# EAGLE design Motors (EAGLE 7.7.0)
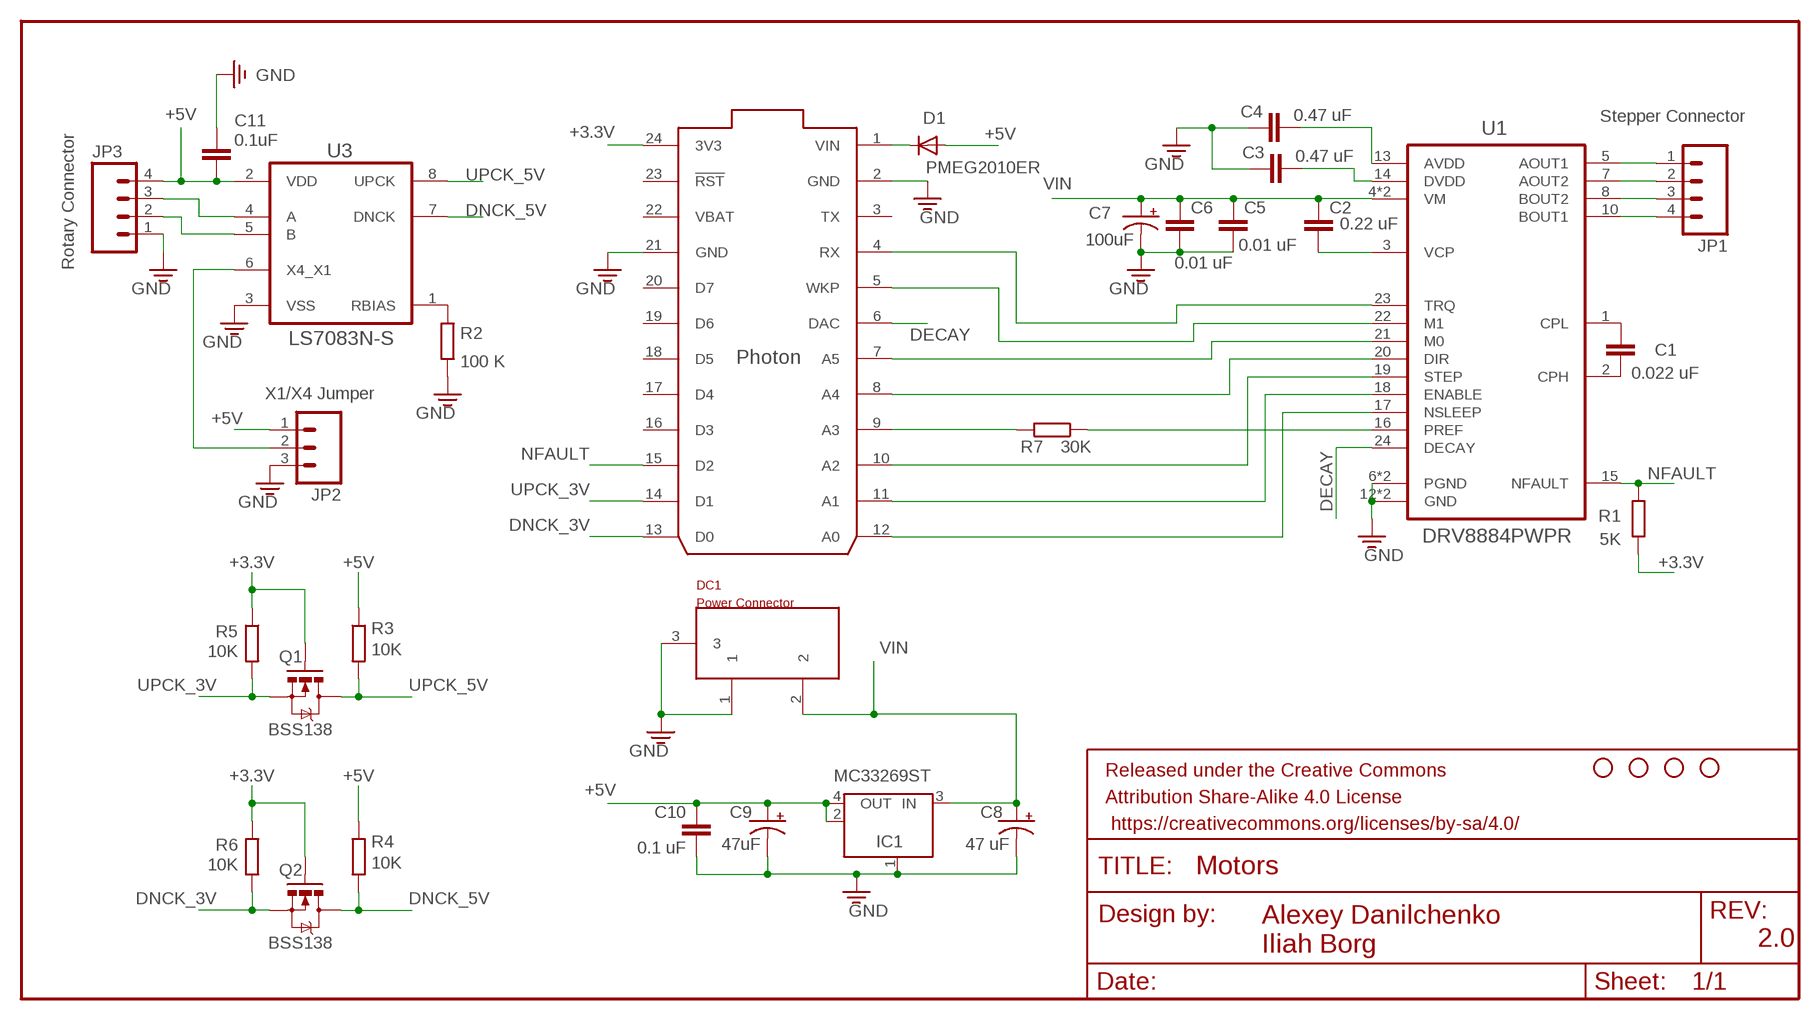
[diagram p0: schematic, sheet 1]

## Parts
C1  0.022 uF  C-EUC0805  [C0805]
C2  0.22 uF  C-EUC0805  [C0805]
C3  0.47 uF  C-EUC0805  [C0805]
C4  0.47 uF  C-EUC0805  [C0805]
C5  0.01 uF  C-EUC0805  [C0805]
C6  0.01 uF  C-EUC0805  [C0805]
C7  100uF  CPOL-USCT7343  [CT7343]
C8  47 uF  CPOL-USCT7343  [CT7343]
C9  47uF  CPOL-USCT7343  [CT7343]
C10  0.1 uF  C-EUC0805  [C0805]
C11  0.1uF  C-EUC0805  [C0805]
D1  PMEG2010ER  DIODE-SOD123  [SOD123]
DC1  Power Connector  POWERSUPPLY_DC21MMX  [POWERSUPPLY_DC-21MM]
FRAME1  FRAME-LETTER  [CREATIVE_COMMONS]
IC1  MC33269ST  [SOT223]
JP1  Stepper Connector  M04PTH  [1X04]
JP2  X1/X4 Jumper  M03PTH  [1X03]
JP3  Rotary Connector  M04PTH  [1X04]
Q1  BSS138  MOSFET-NCHANNELSMD  [SOT23-3]
Q2  BSS138  MOSFET-NCHANNELSMD  [SOT23-3]
R1  5K  R-EU_R0805  [R0805]
R2  100 K  R-EU_R0805  [R0805]
R3  10K  R-EU_R0805  [R0805]
R4  10K  R-EU_R0805  [R0805]
R5  10K  R-EU_R0805  [R0805]
R6  10K  R-EU_R0805  [R0805]
R7  30K  R-EU_R0805  [R0805]
STANDOFF1  STAND-OFF  [STAND-OFF]
STANDOFF2  STAND-OFF  [STAND-OFF]
STANDOFF3  STAND-OFF  [STAND-OFF]
STANDOFF4  STAND-OFF  [STAND-OFF]
U1  DRV8884PWPR  [SOP65P640X120-29N]
U2  PHOTON_WITH_HEADERS  [PHOTON]
U3  LS7083N-S  LSI7083N-S  [SOIC127P600X175-8N]

## Nets
+3.3V: Q1.1(G) Q2.1(G) R1.1 R5.1 R6.1 U2.24(3V3)
+5V: C9.+ C10.1 C11.2 D1.A IC1.2(OUT) IC1.4(OUT) JP2.1 JP3.4 R3.1 R4.1 U3.2(VDD)
DECAY: U1.24(DECAY) U2.6(DAC)
DNCK_3V: Q2.2(S) R6.2 U2.13(D0)
DNCK_5V: Q2.3(D) R4.2 U3.7(DNCK)
GND: C3.2 C4.2 C5.2 C6.2 C7.- C8.- C9.- C10.2 C11.1 DC1.1 DC1.3 IC1.1(GND/ADJ) JP2.3 JP3.1 R2.2 U1.6(PGND) U1.9(PGND) U1.12(GND) U1.25(GND) U2.2(GND) U2.21(GND) U3.3(VSS)
N$1: U1.18(ENABLE) U2.11(A1)
N$2: C2.2 U1.3(VCP)
N$3: C1.1 U1.2(CPH)
N$4: C1.2 U1.1(CPL)
N$5: U1.22(M1) U2.5(WKP)
N$6: U1.17(NSLEEP) U2.12(A0)
N$7: R7.1 U1.16(PREF)
N$8: C4.1 U1.13(AVDD)
N$9: C3.1 U1.14(DVDD)
N$10: D1.C U2.1(VIN)
N$11: U1.19(STEP) U2.10(A2)
N$12: U1.20(DIR) U2.8(A4)
N$13: U1.21(M0) U2.7(A5)
N$14: U1.23(TRQ) U2.4(RX)
N$15: R7.2 U2.9(A3)
N$18: R2.1 U3.1(RBIAS)
N$19: JP1.1 U1.5(AOUT1)
N$20: JP1.2 U1.7(AOUT2)
N$21: JP2.2 U3.6(X4_X1)
N$22: JP1.3 U1.8(BOUT2)
N$23: JP1.4 U1.10(BOUT1)
NFAULT: R1.2 U1.15(NFAULT) U2.15(D2)
ROTARY_A: JP3.3 U3.4(A)
ROTARY_B: JP3.2 U3.5(B)
UPCK_3V: Q1.2(S) R5.2 U2.14(D1)
UPCK_5V: Q1.3(D) R3.2 U3.8(UPCK)
VIN: C2.1 C5.1 C6.1 C7.+ C8.+ DC1.2 IC1.3(IN) U1.4(VM) U1.11(VM)
Unconnected: U2.3(TX) U2.16(D3) U2.17(D4) U2.18(D5) U2.19(D6) U2.20(D7) U2.23(!RST)

## Power pins joined to a net without a drawn wire
VBAT: U2.22(VBAT)

## Library data of the parts
C1-C6 C10 C11 = Spectron2:C-EU: CAPACITOR, European symbol
C7-C9 = Spectron2:CPOL-US: POLARIZED CAPACITOR, American symbol
D1 = Spectron2:DIODE-: DIODE
DC1 = Spectron2:POWERSUPPLY_DC21MM
FRAME1 = SparkFun-Aesthetics:FRAME-LETTER: Schematic Frame Standard 8.5x11 US Letter frame
IC1 = Spectron:MC33269ST*: Adjustable Output Low Dropout Voltage Regulator 800 mA Source: http://www.onsemi.com/pub/Collateral/MC33269-D.PDF
JP1 JP3 = SparkFun-Connectors:M04: Header 4 Standard 4-pin 0.1" header. Use with straight break away headers (SKU : PRT-00116), right angle break away headers (PRT-00553), swiss pins (PRT-00743), machine pins (PRT-00117), and female headers (PRT-00115). Molex polarized connector foot print use with SKU : PRT-08231 with associated crimp pins and housings. 1MM SMD Version SKU: PRT-10208
JP2 = SparkFun-Connectors:M03: Header 3 Standard 3-pin 0.1" header. Use with straight break away headers (SKU : PRT-00116), right angle break away headers (PRT-00553), swiss pins (PRT-00743), machine pins (PRT-00117), and female headers (PRT-00115). Molex polarized connector foot print use with SKU : PRT-08232 with associated crimp pins and housings.
Q1 Q2 = SparkFun:MOSFET-NCHANNEL
R1-R7 = Spectron2:R-EU_: RESISTOR, European symbol
STANDOFF1-STANDOFF4 = Spectron2:STAND-OFF: #4 Stand Off This is the mechanical footprint for a #4 phillips button head screw. Use the keepout ring to avoid running the screw head into surrounding components. SKU : PRT-00447
U1 = TI-DRV8884:DRV8884PWPR: STEPPER MOTOR CONTROLLER; MPN: DRV8884PWPR; OC_FARNELL: -; OC_NEWARK: 24R9117; PACKAGE: TSSOP-28; SUPPLIER: Texas Instruments
U2 = Spectron2:PHOTON
U3 = LSI-LS7083NS:LSI7083N-S: Precision Micropower, Low Dropout Voltage References; MPN: LS7083N-S; OC_FARNELL: -; PACKAGE: SOIC-8; SUPPLIER: LSI/CSI

## Board
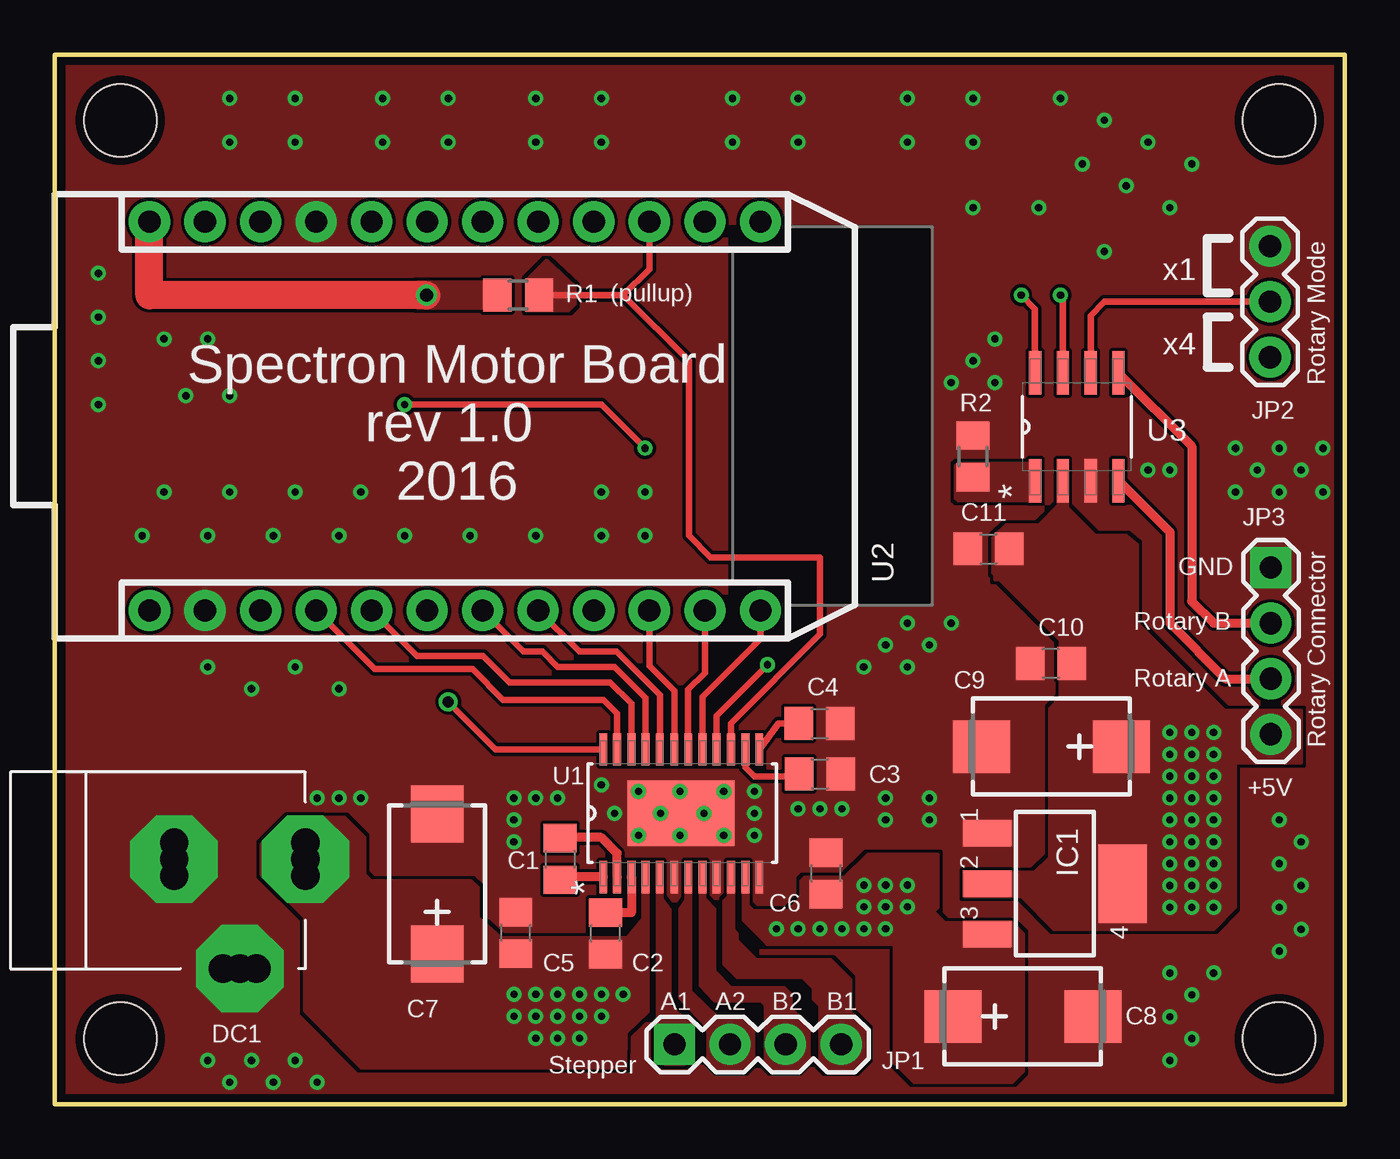
[diagram p1: board, top side]
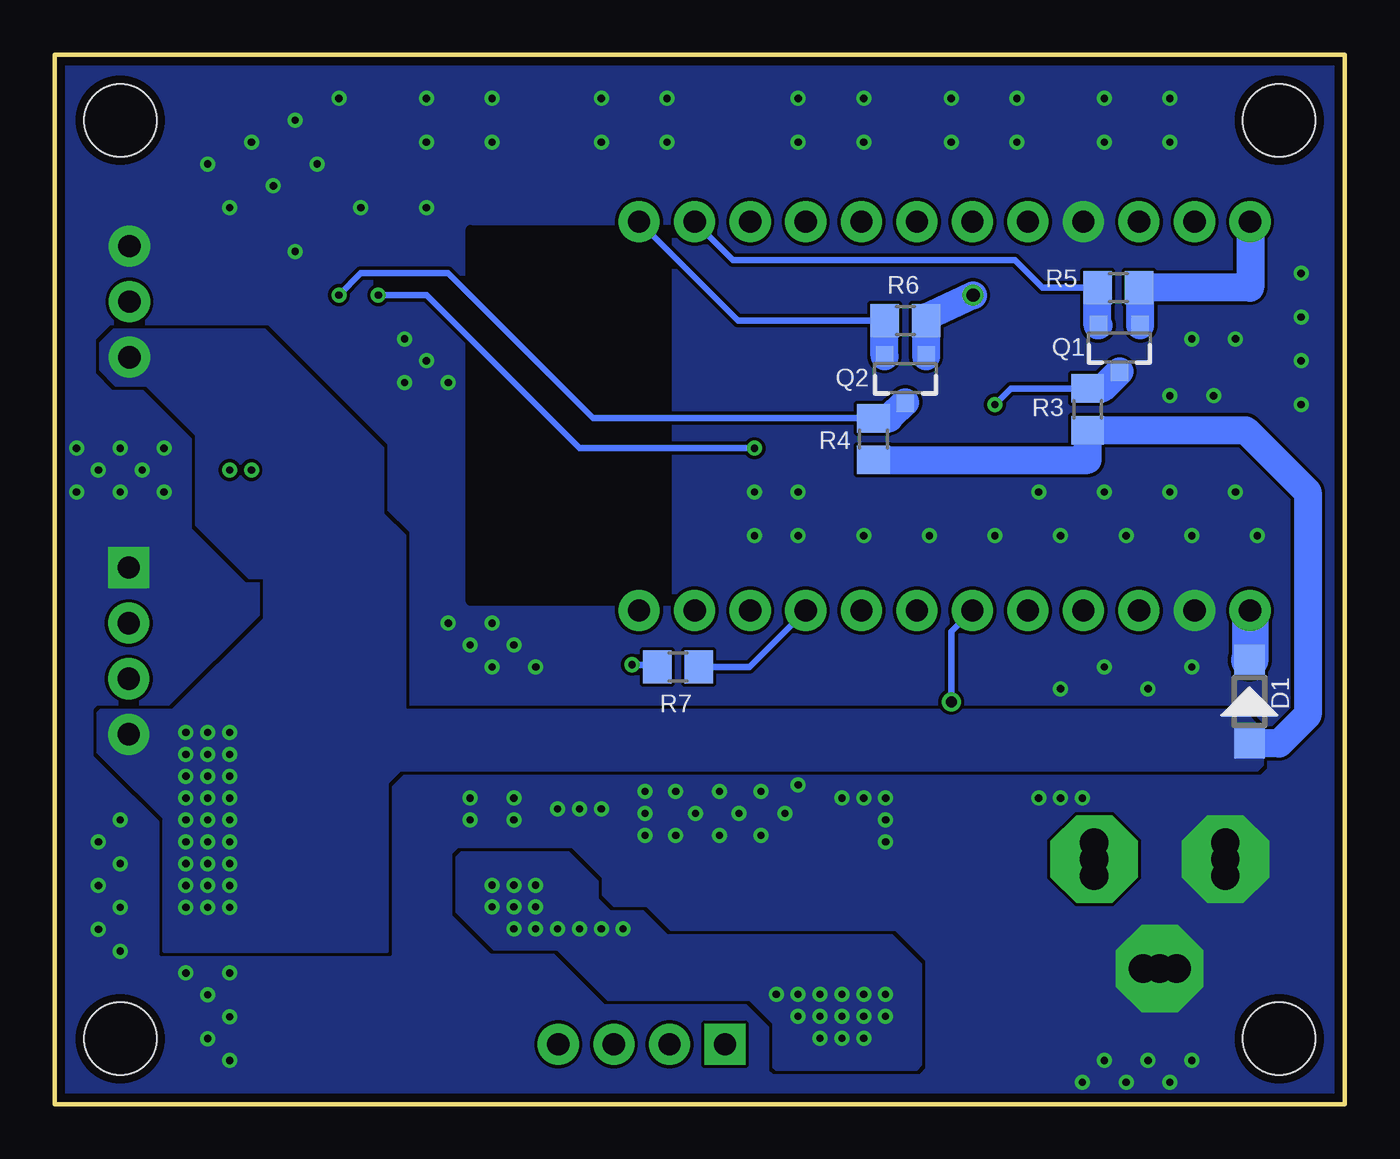
[diagram p2: board, bottom side, seen from below]

Size 59 x 48 mm. Coordinates in mm from the lower left corner, seen from the top.
Outline: 59,0 59,48 0,48 0,0 59,0
Copper layers (1*16): Top 0.0356mm / dielectric 1.5011mm / Bottom 0.0356mm
Design rules "oshpark-2layer *": minimum track width 6mil, minimum drill 13mil, track to track 6mil, track to pad 6mil, pad to pad 6mil, via to via 6mil, smd to smd 0mil, copper to edge 15mil, drill to drill 6mil, minimum pad ring 7mil, minimum via ring 7mil, stop-mask expansion 2.5mil, vias tented up to drill 0mil, thermal gap 10mil

### Footprints (pad centres in the part's own frame; a part is rotated, then mirrored left to right if it is on the bottom)
C0805 = smd 1.3 x 1.5: 1 -0.95,0; 2 0.95,0
CT7343 = smd 2.6 x 2.4: + 3.2,0; - -3.2,0
SOD123 = smd 1.4 x 1.4: A 1.9,0; C -1.9,0
POWERSUPPLY_DC-21MM = drill 1.3 pad 4 octagon: 1 -5.08,-3.353; 2 -0.076,-6.35; 3 -0.076,-0.356 | drill 1.3: 4 -5.08,-4.115; 5 -5.08,-2.591; 6 -0.838,-0.356; 7 0.686,-0.356; 8 -0.838,-6.35; 9 0.686,-6.35
SOT223 = smd 1.219 x 2.235: 1 -2.311,-3.099; 2 0,-3.099; 3 2.311,-3.099 | smd 3.6 x 2.2: 4 0,3.099
1X04 = drill 1.016 pad 1.88 square: 1 0,0 | drill 1.016 pad 1.88: 2 2.54,0; 3 5.08,0; 4 7.62,0
1X03 = drill 1.016 pad 1.88: 1 0,0; 2 2.54,0; 3 5.08,0
SOT23-3 = smd 0.8 x 0.9: 1 -0.95,-1; 2 0.95,-1; 3 0,1.1
R0805 = smd 1.3 x 1.5: 1 -0.95,0; 2 0.95,0
STAND-OFF = hole 3.302: 0,0
SOP65P640X120-29N = smd 1.473 x 0.356: 1 -2.921,3.566; 2 -2.921,2.931; 3 -2.921,2.271; 4 -2.921,1.636; 5 -2.921,0.976; 6 -2.921,0.315; 7 -2.921,-0.32; 8 -2.921,-0.98; 9 -2.921,-1.615; 10 -2.921,-2.276; 11 -2.921,-2.936; 12 -2.921,-3.571; 13 2.921,-3.571; 14 2.921,-2.936; 15 2.921,-2.276; 16 2.921,-1.615; 17 2.921,-0.98; 18 2.921,-0.32; 19 2.921,0.315; 20 2.921,0.976; 21 2.921,1.636; 22 2.921,2.271; 23 2.921,2.931; 24 2.921,3.566 | smd 3 x 4.9: 25 0,0
PHOTON = drill 1.016 pad 1.88: 1 1.27,32.258; 2 1.27,29.718; 3 1.27,27.178; 4 1.27,24.638; 5 1.27,22.098; 6 1.27,19.558; 7 1.27,17.018; 8 1.27,14.478; 9 1.27,11.938; 10 1.27,9.398; 11 1.27,6.858; 12 1.27,4.318; 13 19.05,4.318; 14 19.05,6.858; 15 19.05,9.398; 16 19.05,11.938; 17 19.05,14.478; 18 19.05,17.018; 19 19.05,19.558; 20 19.05,22.098; 21 19.05,24.638; 22 19.05,27.178; 23 19.05,29.718; 24 19.05,32.258
SOIC127P600X175-8N = smd 1.981 x 0.559: 1 -2.464,1.905; 2 -2.464,0.635; 3 -2.464,-0.635; 4 -2.464,-1.905; 5 2.464,-1.905; 6 2.464,-0.635; 7 2.464,0.635; 8 2.464,1.905

### Placement (x,y rotation side)
C1  23.11,11.21 270 top
C2  25.19,7.81 90 top
C3  34.99,15.11 0 top
C4  34.97,17.41 0 top
C5  21.09,7.83 90 top
C6  35.28,10.56 90 top
C7  17.49,10.08 270 top
C8  44.27,4.01 180 top
C9  45.58,16.35 0 top
C10  45.56,20.16 180 top
C11  42.7,25.4 0 top
D1  4.36,18.42 270 bottom
DC1  5.11,11.28 90 top
FRAME1  3.96,40.12 0 top
IC1  45.74,10.09 270 top
JP1  28.35,2.73 0 top
JP2  55.58,34.16 90 top
JP3  55.62,24.54 270 top
Q1  10.31,34.61 180 bottom
Q2  20.1,33.21 180 bottom
R1  21.2,37 0 top
R2  41.99,29.63 90 top
R3  11.76,31.78 90 bottom
R4  21.56,30.42 90 bottom
R5  10.36,37.34 180 bottom
R6  20.1,35.84 180 bottom
R7  30.5,20 0 bottom
STANDOFF1  56,3 0 top
STANDOFF2  56,45 0 top
STANDOFF3  3,3 0 top
STANDOFF4  3,45 0 top
U1  28.65,13.31 90 top
U2  36.59,21.31 90 top
U3  46.74,30.98 90 top

### Tracks (layer width: path | path; a pad name or v marks a point on that pad's centre or on a via)
+3.3V  (via drill 0.6)
  Top 1.27: v17,37 4.33,37 U2.24
  Bottom 1.27: U2.24 4.33,37.34 R5.1 9.36,37.34 Q1.1 | v17,37 19.15,36 R6.1 Q2.1
  pour Top (no thermals): 16.6,37.6 20.8,37.6 20.8,36.4 16.6,36.4
+5V  (via drill 0.33)
  Bottom 1.27: D1.A 4.34,16.5 3,16.5 1.7,17.8 1.7,28 4.53,30.83 R3.1 11.76,29.47 R4.1
  other vias: 51,17 52,17 53,17 53,16 53,15 53,14 53,13 53,12 52,16 52,15 52,14 52,13 52,12 51,12 51,13 51,16 51,15 51,14 51,11 52,11 53,11 51,10 52,10 53,10 53,9 52,9 51,9
  pour Bottom (no thermals): 3.78,15.96 3.78,15.52 4,15.3 43.8,15.3 43.8,7 54,7 54,18 4.7,18 3.77,17.07 3.77,16.19 arc90 3.96,16 4,16
  pour Top (no thermals): 45.9,28.9 45.9,27.4 45,26.5 43.5,26.5 43,26 43,24 49,24 49,26 47.6,26 46.3,27.3 46.3,28.9
  pour Top (no thermals): 41.6,10.6 44.8,10.6 45.5,11.3 45.5,18.1 46,18.6 46,21.2 42.9,24.3 42.9,25.9 43,26 49,26 49.5,25.6 49.5,22 53.5,18 57,18 57,15.6 54,15.6 54,9 53,8 45.7,8 44.2,9.5 41.6,9.5
  pour Bottom (no thermals): 56.7,35 56.3,35.4 53.2,35.4 49.4,35.4 44,30 44,27 43,26 43,24.2 43.1,24.1 50.1,24.1 52.5,26.5 52.5,30.6 54.8,32.9 56.2,32.9 56.9,33.6 56.9,34.8
  pour Bottom (no thermals): 43,25.7 43,15.5 46,12.5 53.4,12.5 57,16.1 57,17.9 56.9,18 53.6,18 49.4,22.2 49.4,25.7 49.1,26 43.9,26 43.3,26
DECAY  (via drill 0.51 pad 0.18)
  Top 0.305: U1.24 20.17,16.23 v18,18.4
  Bottom 0.305: v18,18.4 18,21.61 U2.6
DNCK_3V
  Bottom 0.305: U2.13 27.75,35.84 R6.2
  Bottom 1.27: Q2.2 R6.2
DNCK_5V  (via drill 0.33)
  Top 0.305: v46,37 46.1,36.9 U3.7
  Bottom 0.305: R4.2 34.37,31.37 41,38 45,38 v46,37
  Bottom 1.27: Q2.3 20.84,31.37 R4.2
GND  (via drill 0.33 pad 0.18)
  other vias: 10,26 14,28 16,26 19,26 22,26 25,26 27,28 8,28 5,28 4,26 7,26 27,26 25,28 8,46 11,46 11,44 8,44 15,44 18,44 18,46 15,46 22,46 25,46 25,44 22,44 2,38 2,36 2,34 31,46 31,44 2,32 5,35 7,35 34,46 34,44 39,46 42,46 42,44 39,44 46,46 48,45 50,44 52,43 47,43 49,42 51,41 45,41 42,41 48,39 54,30 51,29 50,29 56,30 41,22 39,22 38,21 37,20 39,20 40,21 38,14 40,14 40,13 38,13 32,14.3 32,13.3 32,12.3 25,14.6 25.6,13.3 36,13.5 35,13.5 34,13.5 30.6,14.3 29.7,13.3 28.6,12.3 28.6,14.3 26.7,14.3 26.7,12.3 27.7,13.3 30.6,12.3 23,14 22,14 21,14 21,13 21,12 14,14 13,14 12,14 13,19 11,20 9,19 7,20 7,2 9,2 11,2 10,1 8,1 12,1 56,13 57,12 56,11 56,9 56,7 57,10 57,8 51,6 52,5 53,6 51,4 52,3 51,2 55,29 57,29 58,30 56,28 54,28 58,28 42,34 43,35 41,33 43,33 6,32.4 8,32.4 11,28 13,26
  pour Top (rank 6, no thermals): 0,0 59,0 59,48 0,48
  pour Bottom (rank 6, no thermals): 0,0 59,0 59,48 0,48
N$1
  Top 0.305: U1.18 28.97,18.97 29.73,19.73 U2.11
N$2
  Top 0.406: U1.3 26.38,8.76 C2.2
N$3
  Top 0.406: U1.2 25.72,11.48 25,12.2 23.45,12.2 C1.1
N$4
  Top 0.406: U1.1 23.54,10.39 C1.2
N$5
  Top 0.305: U1.22 26.38,18.32 25.4,19.3 20.8,19.3 19.6,20.5 16.57,20.5 U2.5
N$6
  Top 0.305: U1.17 29.63,18.63 32.27,21.27 U2.12
N$7  (via drill 0.33 pad 0.18)
  Top 0.305: U1.16 30.27,17.77 v32.6,20.1
  Bottom 0.305: v32.6,20.1 31.55,20.1 R7.1
N$8
  Top 0.305: U1.13 33.1,17.41 C4.1
N$9
  Top 0.305: U1.14 31.59,15.41 32,15 33.93,15 C3.1
N$10
  Bottom 1.676: D1.C 4.33,20.35 U2.1
N$11
  Top 0.305: U1.19 28.34,18.9 27.19,20.04 U2.10
N$12
  Top 0.305: U1.20 27.67,18.73 25.7,20.7 23.99,20.7 U2.8
N$13
  Top 0.305: U1.21 27.01,18.59 25.6,20 23,20 22.3,20.7 21.45,20.7 U2.7
N$14
  Top 0.305: U1.23 25.72,17.88 25.1,18.5 20.5,18.5 19.1,19.9 14.63,19.9 U2.4
N$15
  Bottom 0.305: R7.2 27.23,20 U2.9
N$18
  pour Top (no thermals): 41.4,29.3 45,29.3 45,27.7 44.9,27.6 41.3,27.6 41.2,27.7 41.2,29.2 41.3,29.3
N$19
  pour Top (no thermals): 27.57,10.38 27.57,2.13 27.89,1.83 28.8,1.83 29.11,2.13 29.11,3.66 28.13,4.49 28.13,8.92 27.78,9.4 27.78,10.4 27.6,10.4
N$20
  pour Top (no thermals): 28.88,10.51 28.87,9.35 28.59,8.93 28.59,4.83 29.87,3.51 29.87,1.98 30.33,1.52 31.55,1.52 31.96,1.93 31.96,3.4 31.39,3.96 30.33,3.96 29.08,5.17 29.08,10.51
N$21
  Top 0.305: U3.6 47.38,36.08 48,36.7 JP2.2
N$22
  pour Top (no thermals): 29.57,10.52 29.53,10.46 29.53,5.41 30.18,4.72 32.31,4.72 32.5,4.53 32.5,1.8 32.78,1.52 33.99,1.52 34.49,2.03 34.49,3.51 33.68,4.42 33.68,5.03 33.38,5.33 30.94,5.33 30.18,6.1 30.18,8.94 29.73,9.42 29.73,10.54
N$23
  pour Top (no thermals): 30.82,10.5 30.82,9.5 30.6,9.3 30.6,6.4 31.2,5.8 34.2,5.8 34.7,5.3 34.7,4.8 35,4.5 35,1.8 35.3,1.5 36.6,1.5 37.2,2.1 37.2,3.4 36.4,4.2 36.4,5.7 35.5,6.6 32.1,6.6 31.2,7.5 31.2,7.8 31.04,8.01 31.04,10.51
N$25
  cutout Bottom: 40,23 40,40 31,40 31,23
N$26
  cutout Top: 40,23 40,40 31,40 31,23
NFAULT
  Top 0.305: R1.2 26,37 | 26,37 27.19,38.19 U2.15 | U1.15 30.93,17.43 35,21.5 35,25 30,25 29,26 29,34 26,37
  pour Top (no thermals): 22.5,38.6 23.8,37.4 23.8,36.6 23.5,36.3 21.6,36.3 21.6,37.6 21.6,37.7
ROTARY_A
  Top 0.406: U3.4 51,26.16 51,22 53.54,19.46 JP3.3
ROTARY_B
  Top 0.406: U3.5 52,30.09 52,23 53,22 JP3.2
UPCK_3V
  Bottom 0.305: U2.14 27.97,38.6 15.1,38.6 13.84,37.34 R5.2
  Bottom 1.27: Q1.2 11.31,35.61 R5.2
UPCK_5V  (via drill 0.33)
  Top 0.305: v16,32 25,32 v27,30 | v44.2,37 44.84,36.37 U3.8
  Bottom 0.305: R3.2 15.27,32.73 v16,32 | v27,30 35,30 42,37 v44.2,37
  Bottom 1.27: R3.2 11.09,32.73 Q1.3
VIN  (via drill 0.33 pad 0.18)
  other vias: 26,5.02 25,5.02 24,5.02 23,5.02 22,5.02 21,5.02 21,4.02 22,4.02 23,4.02 24,4.02 25,4.02 23,3.02 24,3.02 22,3.02 33,8.02 34,8.02 35,8.02 36,8.02 37,8.02 38,8.02 38,9.02 37,9.02 37,10.02 38,10.02 39,10.02 39,9.02
  pour Top (no thermals): 26.9,10.5 26.9,8.5 26.17,7.62 20.42,7.62 19.35,8.53 19.35,9.91 19.05,10.21 14.48,10.21 14.17,10.52 14.17,12.19 13.26,13.11 10.67,13.11 9.45,11.89 9.45,10.52 11.43,8.53 11.43,4.27 14.02,1.68 26.11,1.68 26.12,3.26 27.13,4.23 27.13,9.6 27.13,10.52 26.97,10.52
  pour Top (no thermals): 31.5,10.6 31.5,8.4 32.43,7.47 32.58,7.32 38.71,7.32 40.39,8.99 40.39,11.43 37.19,11.43 36.12,10.36 34.29,10.36 34.14,10.21 34.14,9.45 33.53,8.84 31.96,8.84 31.7,9.1 31.7,10.6
  pour Bottom (no thermals): 33.9,9.1 34.2,9.4 34.2,10.2 35.4,11.4 35.5,11.5 40.4,11.5 40.6,11.3 40.6,8.8 38.9,7.1 36,7.1 33.7,4.8 27.2,4.8 26.1,3.7 26.1,1.7 26,1.6 19.6,1.6 19.4,1.8 19.4,6.4 20.7,7.7 31,7.7 32.1,8.8 33.4,8.8 33.6,8.8
  pour Top (no thermals): 40,9 40.7,8.3 43.8,8.3 44.3,7.8 44.3,1.5 43.8,1 39.3,1 38.4,1.9 38.4,7.6 39.8,9

### Text on the board
tPlace: x1 | (pullup) | x4 | Rotary Mode | Spectron Motor Board / rev 1.0 / 2016 | GND | Rotary B | Rotary Connector | Rotary A | +5V | A1 | A2 | B2 | B1 | Stepper